# Altium schematic sheet ESP32.SchDoc
size A4
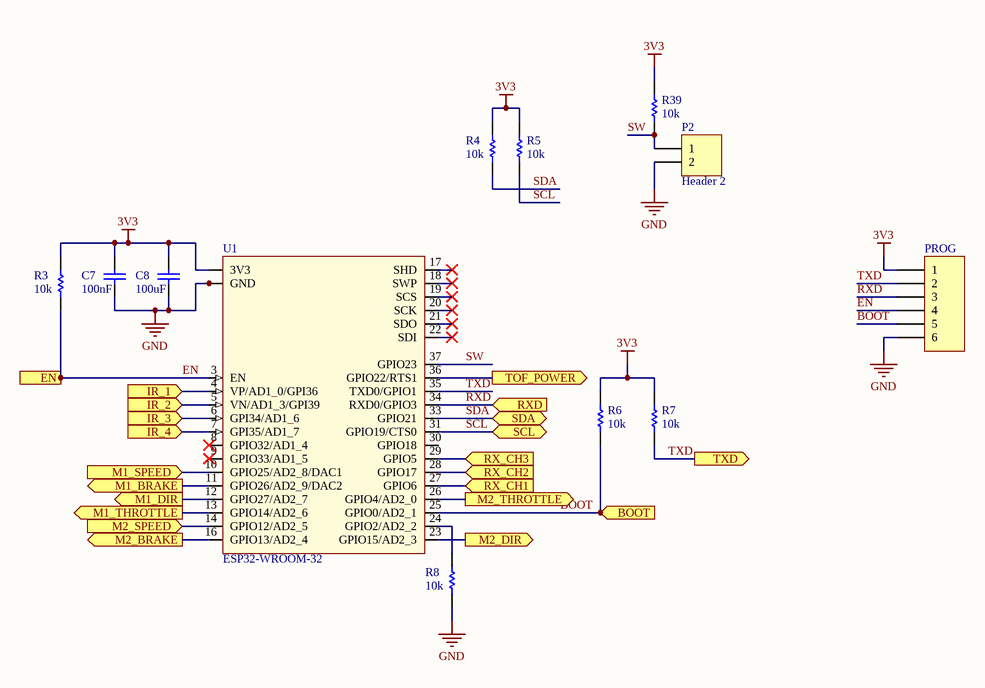
[diagram p0: ESP32.SchDoc]

## Parts
C7  value 100nF  [J1-0603]  (hidden comment: Cap)
C8  value 100uF  [C1210_M]  (hidden comment: Cap)
P2  Header 2  [HDR1X2]
PROG  Header 6  [HDR1X6]  (value not drawn)
R3  value 10k  [J1-0603]  (hidden comment: Res1)
R4  value 10k  [J1-0603]  (hidden comment: Res1)
R5  value 10k  [J1-0603]  (hidden comment: Res1)
R6  value 10k  [J1-0603]  (hidden comment: Res1)
R7  value 10k  [J1-0603]  (hidden comment: Res1)
R8  value 10k  [J1-0603]  (hidden comment: Res1)
R39  value 10k  [J1-0603]  (hidden comment: Res1)
U1  ESP32-WROOM-32  [ESP32-WROOM-32]

## Ports
BOOT (in), EN (in), IR_1 (in), IR_2 (in), IR_3 (in), IR_4 (in), M1_BRAKE (out), M1_DIR (out), M1_SPEED (in), M1_THROTTLE (out), M2_BRAKE (out), M2_DIR (out), M2_SPEED (in), M2_THROTTLE (out), RX_CH1 (in), RX_CH2 (in), RX_CH3 (in), RXD (in), SCL (bidir), SDA (bidir), TOF_POWER (out), TXD (out)

## Nets
3V3: C7.2 C8.2 PROG.1 R3.2 R4.2 R5.2 R6.2 R7.2 R39.2 U1.2(3V3)
GND: C7.1 C8.1 P2.2 PROG.6 R8.1 U1.1(GND) U1.15(GND) U1.38(GND) U1.39(GND)
BOOT: PROG.5 R6.1 U1.25(GPIO0/AD2_1) ; port BOOT
EN: PROG.4 R3.1 U1.3(EN) ; port EN
IR_1: U1.4(VP/AD1_0/GPI36) ; port IR_1
IR_2: U1.5(VN/AD1_3/GPI39) ; port IR_2
IR_3: U1.6(GPI34/AD1_6) ; port IR_3
IR_4: U1.7(GPI35/AD1_7) ; port IR_4
M1_BRAKE: U1.11(GPIO26/AD2_9/DAC2) ; port M1_BRAKE
M1_DIR: U1.12(GPIO27/AD2_7) ; port M1_DIR
M1_SPEED: U1.10(GPIO25/AD2_8/DAC1) ; port M1_SPEED
M1_THROTTLE: U1.13(GPIO14/AD2_6) ; port M1_THROTTLE
M2_BRAKE: U1.16(GPIO13/AD2_4) ; port M2_BRAKE
M2_DIR: U1.23(GPIO15/AD2_3) ; port M2_DIR
M2_SPEED: U1.14(GPIO12/AD2_5) ; port M2_SPEED
M2_THROTTLE: U1.26(GPIO4/AD2_0) ; port M2_THROTTLE
RX_CH1: U1.27(GPIO6) ; port RX_CH1
RX_CH2: U1.28(GPIO17) ; port RX_CH2
RX_CH3: U1.29(GPIO5) ; port RX_CH3
RXD: PROG.3 U1.34(RXD0/GPIO3) ; port RXD
SCL: R5.1 U1.31(GPIO19/CTS0) ; port SCL
SDA: R4.1 U1.33(GPIO21) ; port SDA
SW: P2.1 R39.1 U1.37(GPIO23)
TOF_POWER: U1.36(GPIO22/RTS1) ; port TOF_POWER
TXD: PROG.2 R7.1 U1.35(TXD0/GPIO1) ; port TXD
NetR8_2: R8.2 U1.24(GPIO2/AD2_2)

Not connected (* = marked no-connect by the designer): U1 8(GPIO32/AD1_4)* 9(GPIO33/AD1_5)* 17(SHD)* 18(SWP)* 19(SCS)* 20(SCK)* 21(SDO)* 22(SDI)* 30(GPIO18)

## Library data of the parts
C7 C8 = Cap: Capacitor; Published: 8-Jun-2000; LatestRevisionDate: 17-Jul-2002; LatestRevisionNote: Re-released for DXP Platform.; PackageReference: RAD-0.3; Publisher: Altium Limited; PackageDescription: Radial Cap, Thru-Hole; 2 Leads; 0.3 in Pin Spacing
  C7: LCSC: C153795
  C8: LCSC: C92794
P2 = Header 2: Header, 2-Pin; LatestRevisionDate: 17-Jul-2002; LatestRevisionNote: Re-released for DXP Platform.; Publisher: Altium Limited
PROG = Header 6: Header, 6-Pin; LatestRevisionDate: 17-Jul-2002; LatestRevisionNote: Re-released for DXP Platform.; Publisher: Altium Limited
R3-R8 R39 = Res1: Resistor; Published: 8-Jun-2000; LatestRevisionDate: 17-Jul-2002; LatestRevisionNote: Re-released for DXP Platform.; PackageReference: AXIAL-0.3; Publisher: Altium Limited; PackageDescription: Axial Device, Thru-Hole; 2 Leads; 0.3 in Pin Spacing